# Altium project PCB_Project.PrjPcb
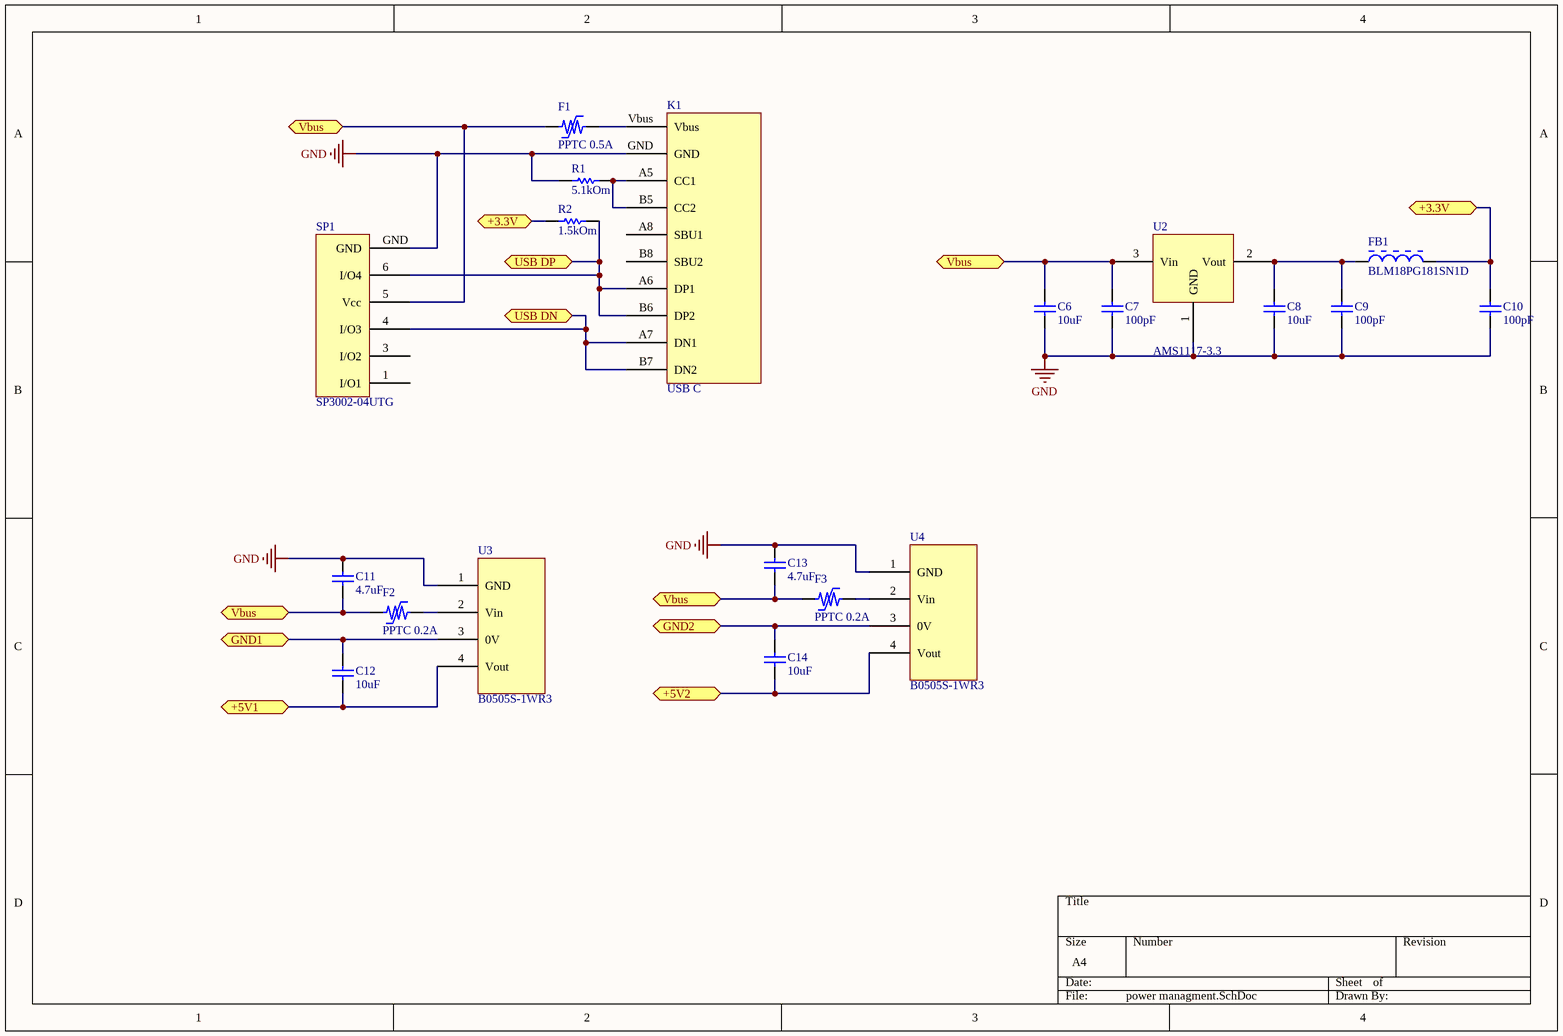
[diagram p0: power managment.SchDoc]
3 sheets, 48 parts. Net scope: flat (ports and power ports of the same name join across sheets).
Board file: 1st attempt.PcbDoc
Sheets:
  power managment.SchDoc
  digital logic.SchDoc
  MCU.SchDoc

## Sheet power managment.SchDoc
size A4

### Parts
C6  10uF  [CAPC1608X90X35ML10T15]
C7  100pF  [CAPC1608X90X35ML10T15]
C8  10uF  [CAPC1608X90X35ML10T15]
C9  100pF  [CAPC1608X90X35ML10T15]
C10  100pF  [CAPC1608X90X35ML10T15]
C11  4.7uF  [CAPC1608X90X35ML10T15]
C12  10uF  [CAPC1608X90X35ML10T15]
C13  4.7uF  [CAPC1608X90X35ML10T15]
C14  10uF  [CAPC1608X90X35ML10T15]
F1  PPTC 0.5A  [PTC 0603]
F2  PPTC 0.2A  [PTC 0603]
F3  PPTC 0.2A  [PTC 0603]
FB1  BLM18PG181SN1D  [MURA-BLM18PG_KG-CHIP-2_V2]
K1  USB C  [USB type C]
R1  5.1kOm  [RESC1608X55X30ML20T10]
R2  1.5kOm  [RESC1608X55X30ML20T10]
SP1  SP3002-04UTG  [uDFN-6]
U2  AMS1117-3.3  [AMS1117]
U3  B0505S-1WR3  [Dip4 package]
U4  B0505S-1WR3  [Dip4 package]

### Ports
+3.3V (bidir), +5V1 (bidir), +5V2 (bidir), GND1 (bidir), GND2 (bidir), USB DN (bidir), USB DP (bidir), Vbus (bidir)

### Nets
GND: C6.1 C7.1 C8.1 C9.1 C10.1 C11.2 C13.2 K1.GND R1.1 SP1.GND U2.1(GND) U3.1(GND) U4.1(GND)
NetC6_2: C6.2 C7.2 C11.1 C13.1 F1.1 F2.1 F3.1 SP1.5(Vcc) U2.3(Vin) ; port Vbus
NetC8_2: C8.2 C9.2 FB1.1 U2.2(Vout)
NetC10_2: C10.2 FB1.2 R2.1 ; port +3.3V
NetC12_1: C12.1 U3.4(Vout) ; port +5V1
NetC12_2: C12.2 U3.3(0V) ; port GND1
NetC14_1: C14.1 U4.4(Vout) ; port +5V2
NetC14_2: C14.2 U4.3(0V) ; port GND2
NetF1_2: F1.2 K1.Vbus
NetF2_2: F2.2 U3.2(Vin)
NetF3_2: F3.2 U4.2(Vin)
NetK1_A5: K1.A5(CC1) K1.B5(CC2) R1.2
NetK1_A6: K1.A6(DP1) K1.B6(DP2) R2.2 SP1.6(I/O4) ; port USB DP
NetK1_A7: K1.A7(DN1) K1.B7(DN2) SP1.4(I/O3) ; port USB DN

Not connected (* = marked no-connect by the designer): K1 A8(SBU1) B8(SBU2); SP1 1(I/O1) 3(I/O2)

### Library data of the parts
C6-C14 = CMP-2006-02335-1: Manufacturer: Murata; Part Number: GCM1885C2A101JA16D
F1-F3 = PTC Resettable Fuse
FB1 = CMP-0686-00566-2: Chip Ferrite Bead for Power Lines, 180 Ohm, 1500 mA, -55 to 125 degC, 1.6 x 0.8 x 0.95 mm SMD, Tape and Reel; Manufacturer: Murata; Impedance (at 100 MHz): 180 Ohm +/- 25%; Rated Current: 1500 mA; DC Resistance: 0.09 Ohm Max.; ComponentLink3Description: Package Specification; PackageDescription: 2-Pin Chip, Body 1.6 x 0.8 mm; Mounting Technology: Surface Mount; ComponentLink1Description: Manufacturer URL; Operating Temperature Range: -55 to 125 degC; Packing: Tape and Reel; DatasheetVersion: 08/2013; ComponentLink3URL: http://www.murata.com/products/catalog/pdf/c31e.pdf; ComponentLink2Description: Datasheet; PartNumber: BLM18PG181SN1D; ComponentLink1URL: http://www.murata.com/; ComponentLink2URL: http://www.murata.com/products/catalog/pdf/c31e.pdf; PackageReference: BLM18_H950-2
R1 R2 = CMP-2000-01555-1: Part Number: RK73H1JTTD5101F; Manufacturer: KOA Speer
SP1 = SP3002-04UTG: ComponentLink1Description: New link; ComponentLink1URL: https://lcsc.com/product-detail/Others_Littelfuse_SP3002-04UTG_Littelfuse-SP3002-04UTG_C207277.html
U3 U4 = B0505S-1WR3: ComponentLink1Description: New link; ComponentLink1URL: https://lcsc.com/product-detail/Power-Modules_B0505S-1WR3_C131038.html

## Sheet digital logic.SchDoc
size A4
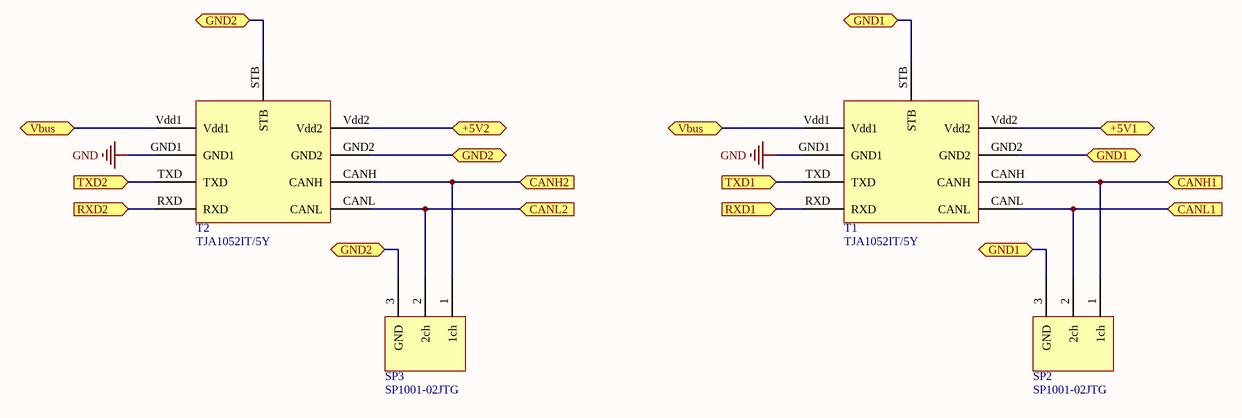
[diagram p1: digital logic.SchDoc]

### Parts
SP2  SP1001-02JTG  [SC70-3]
SP3  SP1001-02JTG  [SC70-3]
T1  TJA1052IT/5Y  [TJA1052]
T2  TJA1052IT/5Y  [TJA1052]

### Ports
+5V1 (bidir), +5V2 (bidir), CANH1 (in), CANH2 (in), CANL1 (in), CANL2 (in), GND1 (bidir), GND2 (bidir), RXD1 (in), RXD2 (in), TXD1 (in), TXD2 (in), Vbus (bidir)

### Nets
GND: T1.GND1 T2.GND1
NetC6_2: T1.Vdd1 T2.Vdd1 ; port Vbus
NetC12_1: T1.Vdd2 ; port +5V1
NetC12_2: SP2.3(GND) T1.GND2 T1.STB ; port GND1
NetC14_1: T2.Vdd2 ; port +5V2
NetC14_2: SP3.3(GND) T2.GND2 T2.STB ; port GND2
NetK2_1: SP2.2(2ch) T1.CANL ; port CANL1
NetK2_2: SP2.1(1ch) T1.CANH ; port CANH1
NetK3_1: SP3.2(2ch) T2.CANL ; port CANL2
NetK3_2: SP3.1(1ch) T2.CANH ; port CANH2
NetT1_RXD: T1.RXD ; port RXD1
NetT1_TXD: T1.TXD ; port TXD1
NetT2_RXD: T2.RXD ; port RXD2
NetT2_TXD: T2.TXD ; port TXD2

### Library data of the parts
T1 T2 = TJA1052IT/5Y: ComponentLink1Description: New link; ComponentLink1URL: https://lcsc.com/product-detail/CAN-ICs_NXP-Semicon_TJA1052IT-5Y_NXP-Semicon-TJA1052IT-5Y_C92210.html

## Sheet MCU.SchDoc
size A4
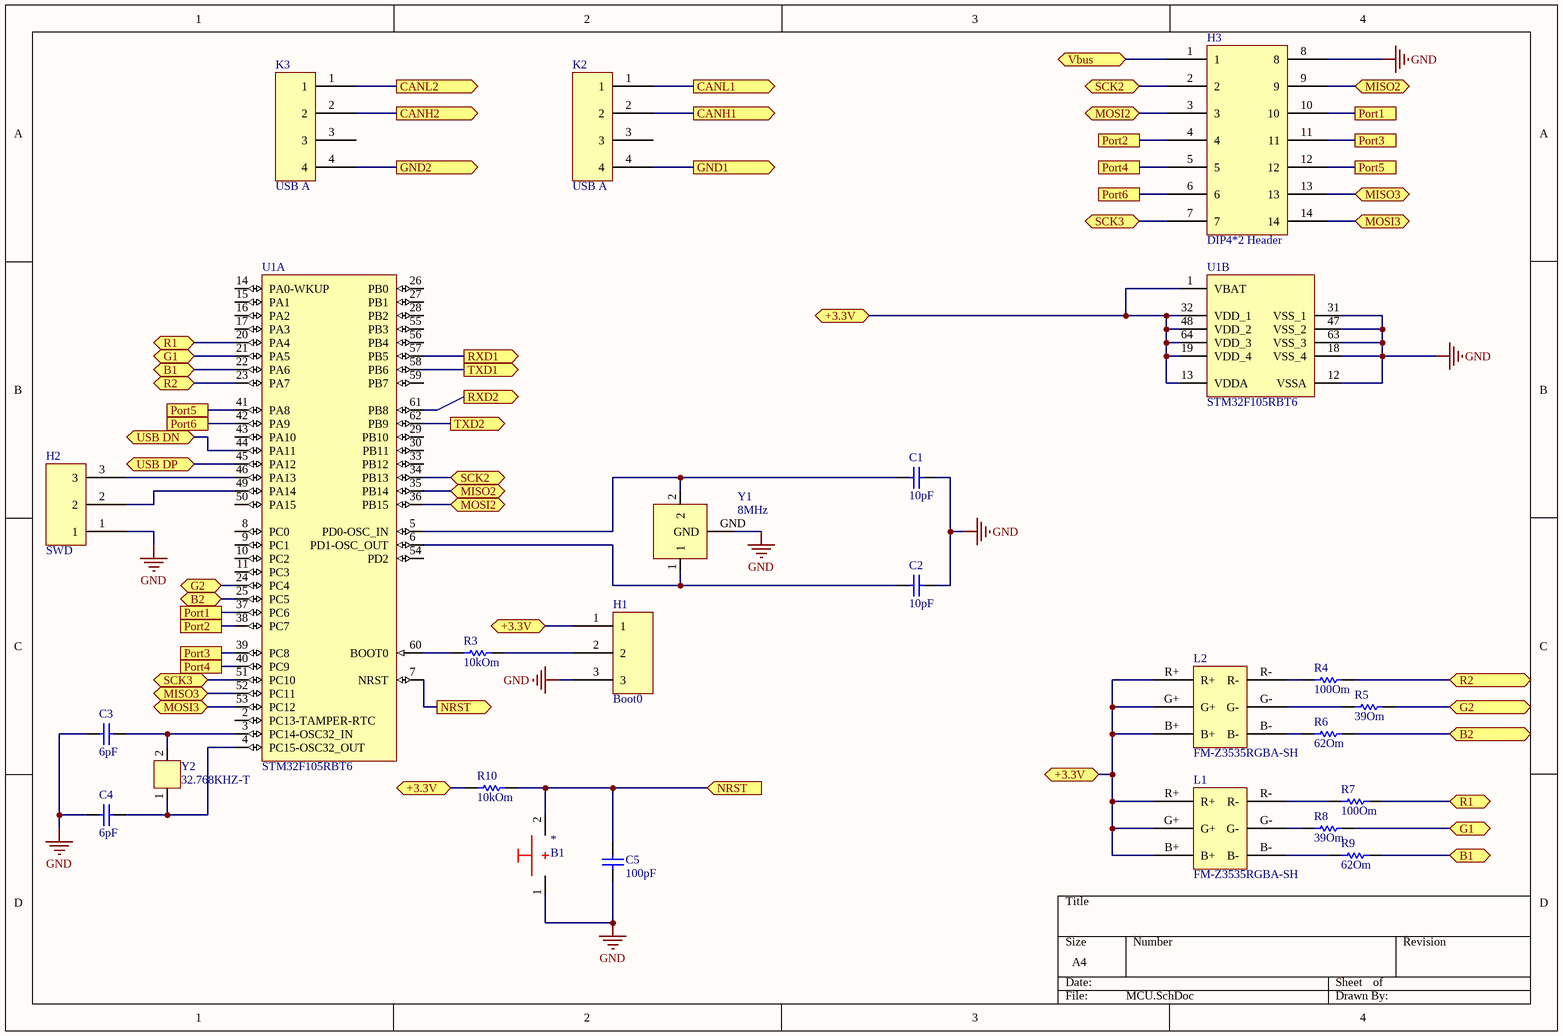
[diagram p2: MCU.SchDoc]

### Parts
*  B1  [Button 3.5x6x4.3mm]
C1  10pF  [CAPC1608X90X35ML10T15]
C2  10pF  [CAPC1608X90X35ML10T15]
C3  6pF  [CAPC1608X90X35ML10T15]
C4  6pF  [CAPC1608X90X35ML10T15]
C5  100pF  [CAPC1608X90X35ML10T15]
H1  Boot0  [DIP3]
H2  SWD  [DIP3]
H3  DIP4*2 Header  [DIP7*2]
K2  USB A  [USB A]
K3  USB A  [USB A]
L1  FM-Z3535RGBA-SH  [Z3535RGBA]
L2  FM-Z3535RGBA-SH  [Z3535RGBA]
R3  10kOm  [RESC1608X55X30ML20T10]
R4  100Om  [RESC1608X55X30ML20T10]
R5  39Om  [RESC1608X55X30ML20T10]
R6  62Om  [RESC1608X55X30ML20T10]
R7  100Om  [RESC1608X55X30ML20T10]
R8  39Om  [RESC1608X55X30ML20T10]
R9  62Om  [RESC1608X55X30ML20T10]
R10  10kOm  [RESC1608X55X30ML20T10]
U1  STM32F105RBT6  [STM-LQFP64_V]  (parts A,B of 2)
Y1  8MHz  [SMD-5032 resonator]
Y2  32.768KHZ-T  [SMD-2012]

### Ports
+3.3V (bidir), B1 (bidir), B2 (bidir), CANH1 (out), CANH2 (out), CANL1 (out), CANL2 (out), G1 (bidir), G2 (bidir), GND1 (out), GND2 (out), MISO2 (bidir), MISO3 (bidir), MOSI2 (bidir), MOSI3 (bidir), NRST (in), NRST (out), Port1, Port2, Port3, Port4, Port5, Port6, R1 (bidir), R2 (bidir), RXD1 (out), RXD2 (out), SCK2 (bidir), SCK3 (bidir), TXD1 (out), TXD2 (out), USB DN (bidir), USB DP (bidir), Vbus (bidir)

### Nets
GND: *.1 C1.2 C2.2 C3.1 C4.1 C5.1 H1.3 H2.1 H3.8 U1.12(VSSA) U1.18(VSS_4) U1.31(VSS_1) U1.47(VSS_2) U1.63(VSS_3) Y1.GND
Net*_2: *.2 C5.2 R10.2 U1.7(NRST) ; port NRST
NetC1_1: C1.1 U1.5(PD0-OSC_IN) Y1.2
NetC2_1: C2.1 U1.6(PD1-OSC_OUT) Y1.1
NetC3_2: C3.2 U1.3(PC14-OSC32_IN) Y2.2
NetC4_2: C4.2 U1.4(PC15-OSC32_OUT) Y2.1
NetC6_2: H3.1 ; port Vbus
NetC10_2: H1.1 L1.B+ L1.G+ L1.R+ L2.B+ L2.G+ L2.R+ R10.1 U1.1(VBAT) U1.13(VDDA) U1.19(VDD_4) U1.32(VDD_1) U1.48(VDD_2) U1.64(VDD_3) ; port +3.3V
NetC12_2: K2.4 ; port GND1
NetC14_2: K3.4 ; port GND2
NetH1_2: H1.2 R3.2
NetH2_2: H2.2 U1.49(PA14)
NetH2_3: H2.3 U1.46(PA13)
NetH3_2: H3.2 U1.34(PB13) ; port SCK2
NetH3_3: H3.3 U1.36(PB15) ; port MOSI2
NetH3_4: H3.4 U1.38(PC7) ; port Port2
NetH3_5: H3.5 U1.40(PC9) ; port Port4
NetH3_6: H3.6 U1.42(PA9) ; port Port6
NetH3_7: H3.7 U1.51(PC10) ; port SCK3
NetH3_9: H3.9 U1.35(PB14) ; port MISO2
NetH3_10: H3.10 U1.37(PC6) ; port Port1
NetH3_11: H3.11 U1.39(PC8) ; port Port3
NetH3_12: H3.12 U1.41(PA8) ; port Port5
NetH3_13: H3.13 U1.52(PC11) ; port MISO3
NetH3_14: H3.14 U1.53(PC12) ; port MOSI3
NetK1_A6: U1.45(PA12) ; port USB DP
NetK1_A7: U1.44(PA11) ; port USB DN
NetK2_1: K2.1 ; port CANL1
NetK2_2: K2.2 ; port CANH1
NetK3_1: K3.1 ; port CANL2
NetK3_2: K3.2 ; port CANH2
NetL1_B-: L1.B- R9.1
NetL1_G-: L1.G- R8.1
NetL1_R-: L1.R- R7.1
NetL2_B-: L2.B- R6.1
NetL2_G-: L2.G- R5.1
NetL2_R-: L2.R- R4.1
NetR3_1: R3.1 U1.60(BOOT0)
NetR4_2: R4.2 U1.23(PA7) ; port R2
NetR5_2: R5.2 U1.24(PC4) ; port G2
NetR6_2: R6.2 U1.25(PC5) ; port B2
NetR7_2: R7.2 U1.20(PA4) ; port R1
NetR8_2: R8.2 U1.21(PA5) ; port G1
NetR9_2: R9.2 U1.22(PA6) ; port B1
NetT1_RXD: U1.57(PB5) ; port RXD1
NetT1_TXD: U1.58(PB6) ; port TXD1
NetT2_RXD: U1.61(PB8) ; port RXD2
NetT2_TXD: U1.62(PB9) ; port TXD2

Not connected (* = marked no-connect by the designer): K2 3; K3 3; U1 2(PC13-TAMPER-RTC) 8(PC0) 9(PC1) 10(PC2) 11(PC3) 14(PA0-WKUP) 15(PA1) 16(PA2) 17(PA3) 26(PB0) 27(PB1) 28(PB2) 29(PB10) 30(PB11) 33(PB12) 43(PA10) 50(PA15) 54(PD2) 55(PB3) 56(PB4) 59(PB7)

### Library data of the parts
* = Button
C1-C5 = CMP-2006-02335-1: as C6 on sheet power managment
H1 H2 = DIP3 header
R3-R10 = CMP-2000-01555-1: as R1 on sheet power managment
U1 = CMP-0237-00224-3: ARM Cortex-M3 32-bit MCU, 128 KB Flash, 64 KB Internal RAM, 51 I/Os, 64-pin LQFP, -40 to 85 degC, Tray; D/A Converter: 2x12-bit (2 Channel); Supply Voltage(Vcc) min (V): 2; A/D Converter: 2x12-bit (16 Channel); Internal RAM Size (kB): 64; Operating Frequency(F) (Processor speed) (MHz): 72; FLASH Size (Prog) (kB): 128; I/Os (High Current): 51; ComponentLink2Description: Datasheet; Core: ARM Cortex-M3; ComponentLink2URL: http://www.st.com/st-web-ui/static/active/en/resource/technical/document/datasheet/CD00220364.pdf; Mounting Technology: Surface Mount; PackageVersion: Rev. 4, 06/2013; PackageReference: LQFP64; PartNumber: STM32F105RBT6; ComponentLink3URL: http://www.st.com/st-web-ui/static/active/en/resource/technical/document/datasheet/DM00037051.pdf; DatasheetVersion: Rev. 6; PackageDescription: 64-Pin Low Profile Quad Flat Package, 10 x 10 mm Body, 0.5 mm Pitch; ComponentLink3Description: Package Specification; ComponentLink1Description: Manufacturer URL; ComponentLink1URL: http://www.st.com/web/en/home.html; Packing: Tray
Y1 = TXC Corp 7B08070003 resonator
Y2 = Abracon LLC ABS06-107-32.768KHZ-T: ComponentLink1Description: New link; ComponentLink1URL: https://lcsc.com/product-detail/SMD-Crystal-Resonators_Abracon-LLC_ABS06-107-32-768KHZ-T_Abracon-LLC-ABS06-107-32-768KHZ-T_C276418.html
L1 L2 = FM-Z3535RGBA-SH: ComponentLink1Description: New link; ComponentLink1URL: https://lcsc.com/product-detail/Light-Emitting-Diodes-LED_SMDLED-120-480mcd_C110903.html

## Nets that join several sheets
GND: power managment (13 pins), digital logic (T1.GND1 T2.GND1), MCU (15 pins)
NetC6_2: power managment (9 pins), digital logic (T1.Vdd1 T2.Vdd1), MCU (H3.1)
NetC10_2: power managment (C10.2 FB1.2 R2.1), MCU (14 pins)
NetC12_1: power managment (C12.1 U3.4), digital logic (T1.Vdd2)
NetC12_2: power managment (C12.2 U3.3), digital logic (SP2.3 T1.GND2 T1.STB), MCU (K2.4)
NetC14_1: power managment (C14.1 U4.4), digital logic (T2.Vdd2)
NetC14_2: power managment (C14.2 U4.3), digital logic (SP3.3 T2.GND2 T2.STB), MCU (K3.4)
NetK1_A6: power managment (K1.A6 K1.B6 R2.2 SP1.6), MCU (U1.45)
NetK1_A7: power managment (K1.A7 K1.B7 SP1.4), MCU (U1.44)
NetK2_1: digital logic (SP2.2 T1.CANL), MCU (K2.1)
NetK2_2: digital logic (SP2.1 T1.CANH), MCU (K2.2)
NetK3_1: digital logic (SP3.2 T2.CANL), MCU (K3.1)
NetK3_2: digital logic (SP3.1 T2.CANH), MCU (K3.2)
NetT1_RXD: digital logic (T1.RXD), MCU (U1.57)
NetT1_TXD: digital logic (T1.TXD), MCU (U1.58)
NetT2_RXD: digital logic (T2.RXD), MCU (U1.61)
NetT2_TXD: digital logic (T2.TXD), MCU (U1.62)